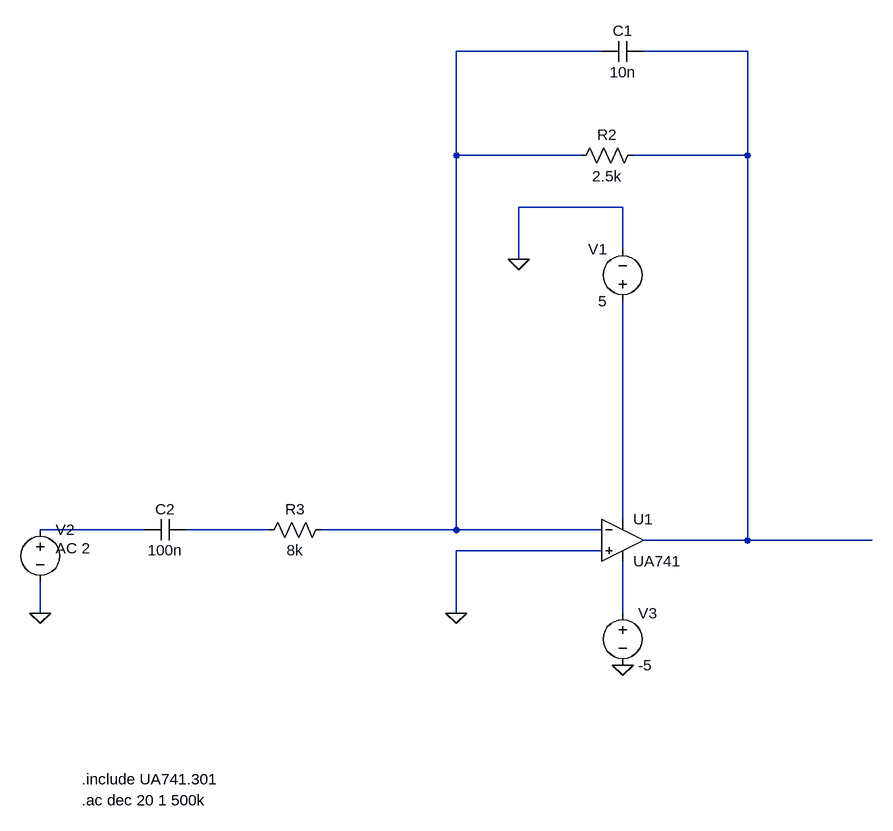
[diagram p0: schematic filter.asc]
filter.asc, the LTspice schematic file:
Version 4
SHEET 1 1744 680
WIRE 1232 -1136 1008 -1136
WIRE 1456 -1136 1296 -1136
WIRE 1008 -976 1008 -1136
WIRE 1200 -976 1008 -976
WIRE 1456 -976 1456 -1136
WIRE 1456 -976 1280 -976
WIRE 1264 -896 1104 -896
WIRE 1264 -832 1264 -896
WIRE 1104 -816 1104 -896
WIRE 1264 -416 1264 -752
WIRE 528 -400 368 -400
WIRE 720 -400 592 -400
WIRE 1008 -400 1008 -976
WIRE 1008 -400 800 -400
WIRE 1232 -400 1008 -400
WIRE 1456 -384 1456 -976
WIRE 1456 -384 1296 -384
WIRE 1648 -384 1456 -384
WIRE 1232 -368 1008 -368
WIRE 368 -272 368 -320
WIRE 1008 -272 1008 -368
WIRE 1264 -272 1264 -352
FLAG 1104 -816 0
FLAG 1008 -272 0
FLAG 368 -272 0
FLAG 1264 -192 0
SYMBOL OpAmps\\opamp2 1264 -448 R0
SYMATTR InstName U1
SYMATTR Value UA741
SYMBOL cap 1296 -1152 R90
WINDOW 0 0 32 VBottom 2
WINDOW 3 32 32 VTop 2
SYMATTR InstName C1
SYMATTR Value 10n
SYMBOL res 1296 -992 R90
WINDOW 0 0 56 VBottom 2
WINDOW 3 32 56 VTop 2
SYMATTR InstName R2
SYMATTR Value 2.5k
SYMBOL res 816 -416 R90
WINDOW 0 0 56 VBottom 2
WINDOW 3 32 56 VTop 2
SYMATTR InstName R3
SYMATTR Value 8k
SYMBOL cap 592 -416 R90
WINDOW 0 0 32 VBottom 2
WINDOW 3 32 32 VTop 2
SYMATTR InstName C2
SYMATTR Value 100n
SYMBOL voltage 368 -416 R0
WINDOW 123 24 44 Left 2
WINDOW 39 0 0 Left 0
SYMATTR Value2 AC 2
SYMATTR InstName V2
SYMATTR Value ""
SYMBOL voltage 1264 -288 R0
WINDOW 123 0 0 Left 0
WINDOW 39 0 0 Left 0
SYMATTR InstName V3
SYMATTR Value -5
SYMBOL voltage 1264 -736 R180
WINDOW 0 24 96 Left 2
WINDOW 3 24 16 Left 2
WINDOW 123 0 0 Left 0
WINDOW 39 0 0 Left 0
SYMATTR InstName V1
SYMATTR Value 5
TEXT 432 -16 Left 2 !.include UA741.301
TEXT 432 16 Left 2 !.ac dec 20 1 500k

The netlist it stands for:
* filter.asc
XU1 0 N001 N003 N006 N002 UA741  ; pins In+ In- V+ V- OUT
C1 N002 N001 10n
R2 N002 N001 2.5k
R3 N001 N005 8k
C2 N005 N004 100n
V2 N004 0 AC 2
V3 N006 0 -5
V1 N003 0 5
.include UA741.301
.ac dec 20 1 500k
.backanno
.end